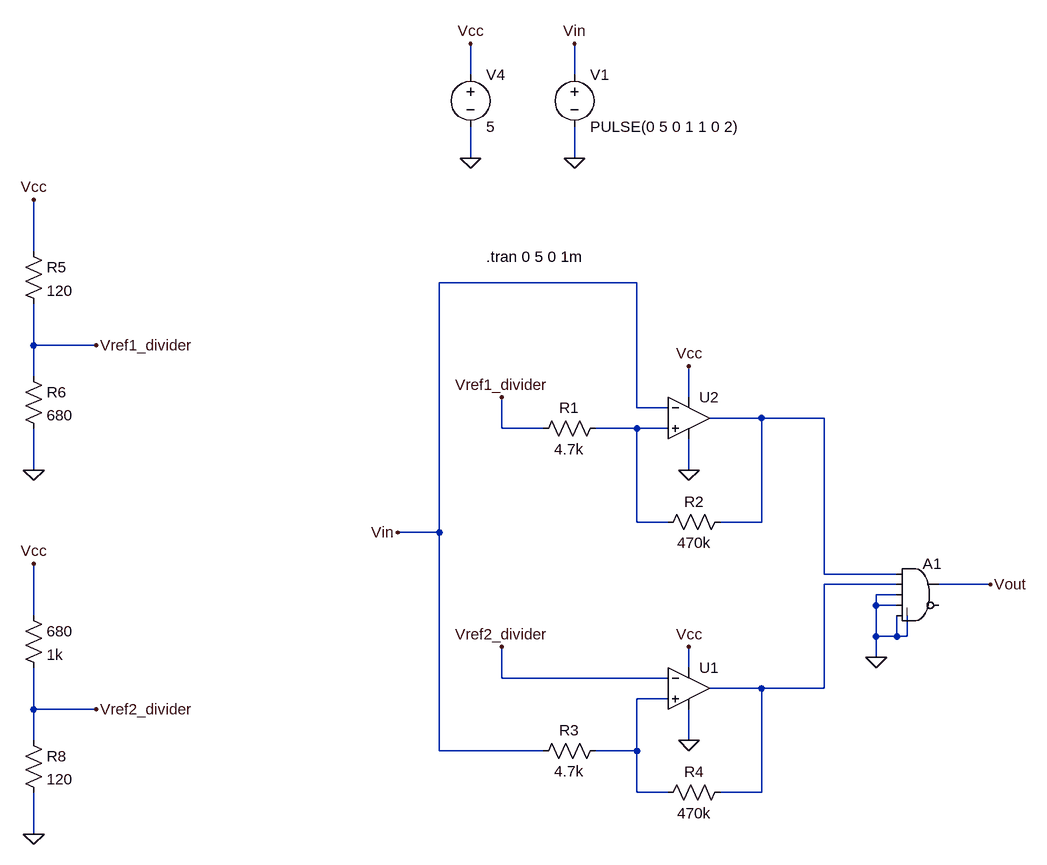
[diagram p0: schematic window_comparator.asc]
window_comparator.asc, the LTspice schematic file:
Version 4.1
SHEET 1 2024 708
WIRE -112 -480 -112 -528
WIRE 48 -480 48 -528
WIRE -112 -352 -112 -400
WIRE 48 -352 48 -400
WIRE -784 -208 -784 -288
WIRE 144 -160 -160 -160
WIRE -784 -64 -784 -128
WIRE -688 -64 -784 -64
WIRE -784 -16 -784 -64
WIRE 224 16 224 -32
WIRE 144 32 144 -160
WIRE 192 32 144 32
WIRE 336 48 256 48
WIRE 432 48 336 48
WIRE -64 64 -64 16
WIRE 0 64 -64 64
WIRE 144 64 80 64
WIRE 192 64 144 64
WIRE -784 128 -784 64
WIRE 224 128 224 80
WIRE 144 208 144 64
WIRE 192 208 144 208
WIRE 336 208 336 48
WIRE 336 208 272 208
WIRE -160 224 -160 -160
WIRE -160 224 -224 224
WIRE 432 288 432 48
WIRE 544 288 432 288
WIRE 544 304 432 304
WIRE 688 304 608 304
WIRE 544 320 512 320
WIRE 512 336 512 320
WIRE 544 336 512 336
WIRE -784 352 -784 272
WIRE 512 384 512 336
WIRE 544 384 544 352
WIRE 544 384 512 384
WIRE 560 384 560 352
WIRE 560 384 544 384
WIRE 512 416 512 384
WIRE 224 432 224 400
WIRE -64 448 -64 400
WIRE 192 448 -64 448
WIRE 336 464 256 464
WIRE 432 464 432 304
WIRE 432 464 336 464
WIRE 192 480 144 480
WIRE -784 496 -784 432
WIRE -688 496 -784 496
WIRE -784 544 -784 496
WIRE 224 544 224 496
WIRE -160 560 -160 224
WIRE 0 560 -160 560
WIRE 144 560 144 480
WIRE 144 560 80 560
WIRE 144 624 144 560
WIRE 192 624 144 624
WIRE 336 624 336 464
WIRE 336 624 272 624
WIRE -784 688 -784 624
FLAG 224 544 0
FLAG 224 128 0
FLAG 48 -352 0
FLAG 48 -528 Vin
FLAG -112 -352 0
FLAG -112 -528 Vcc
FLAG 224 -32 Vcc
FLAG 224 400 Vcc
FLAG -224 224 Vin
FLAG 512 416 0
FLAG 688 304 Vout
FLAG -784 128 0
FLAG -688 -64 Vref1_divider
FLAG -784 -288 Vcc
FLAG -64 16 Vref1_divider
FLAG -784 688 0
FLAG -688 496 Vref2_divider
FLAG -784 272 Vcc
FLAG -64 400 Vref2_divider
SYMBOL OpAmps\\UniversalOpAmp2 224 464 R0
SYMATTR InstName U1
SYMBOL OpAmps\\UniversalOpAmp2 224 48 R0
SYMATTR InstName U2
SYMBOL voltage 48 -496 R0
WINDOW 123 0 0 Left 0
WINDOW 39 0 0 Left 0
SYMATTR InstName V1
SYMATTR Value PULSE(0 5 0 1 1 0 2)
SYMBOL res 288 192 R90
WINDOW 0 0 56 VBottom 2
WINDOW 3 32 56 VTop 2
SYMATTR InstName R2
SYMATTR Value 470k
SYMBOL res 288 608 R90
WINDOW 0 0 56 VBottom 2
WINDOW 3 32 56 VTop 2
SYMATTR InstName R4
SYMATTR Value 470k
SYMBOL voltage -112 -496 R0
WINDOW 123 0 0 Left 0
WINDOW 39 0 0 Left 0
SYMATTR InstName V4
SYMATTR Value 5
SYMBOL res 96 48 R90
WINDOW 0 0 56 VBottom 2
WINDOW 3 32 56 VTop 2
SYMATTR InstName R1
SYMATTR Value 4.7k
SYMBOL res 96 544 R90
WINDOW 0 0 56 VBottom 2
WINDOW 3 32 56 VTop 2
SYMATTR InstName R3
SYMATTR Value 4.7k
SYMBOL Digital\\and 576 256 R0
SYMATTR InstName A1
SYMBOL res -800 -224 R0
SYMATTR InstName R5
SYMATTR Value 120
SYMBOL res -800 -32 R0
SYMATTR InstName R6
SYMATTR Value 680
SYMBOL res -800 336 R0
SYMATTR InstName 680
SYMATTR Value 1k
SYMBOL res -800 528 R0
SYMATTR InstName R8
SYMATTR Value 120
TEXT -88 -200 Left 2 !.tran 0 5 0 1m

The netlist it stands for:
* window_comparator.asc
X§U1 N004 Vref2_divider Vcc 0 N003 level2 Avol=1Meg GBW=10Meg Slew=10Meg Ilimit=25m Rail=0 Vos=0 En=0 Enk=0 In=0 Ink=0 Rin=500Meg  ; pins In+ In- V+ V- OUT
X§U2 N002 Vin Vcc 0 N001 level2 Avol=1Meg GBW=10Meg Slew=10Meg Ilimit=25m Rail=0 Vos=0 En=0 Enk=0 In=0 Ink=0 Rin=500Meg  ; pins In+ In- V+ V- OUT
V1 Vin 0 PULSE(0 5 0 1 1 0 2)
R2 N001 N002 470k
R4 N003 N004 470k
V4 Vcc 0 5
R1 N002 Vref1_divider 4.7k
R3 N004 Vin 4.7k
A1 N001 N003 0 0 0 0 Vout 0 AND
R5 Vcc Vref1_divider 120
R6 Vref1_divider 0 680
R§680 Vcc Vref2_divider 1k
R8 Vref2_divider 0 120
.tran 0 5 0 1m
.lib UniversalOpAmp2.lib
.backanno
.end